# EAGLE design Power_Board (EAGLE 8.2.2)
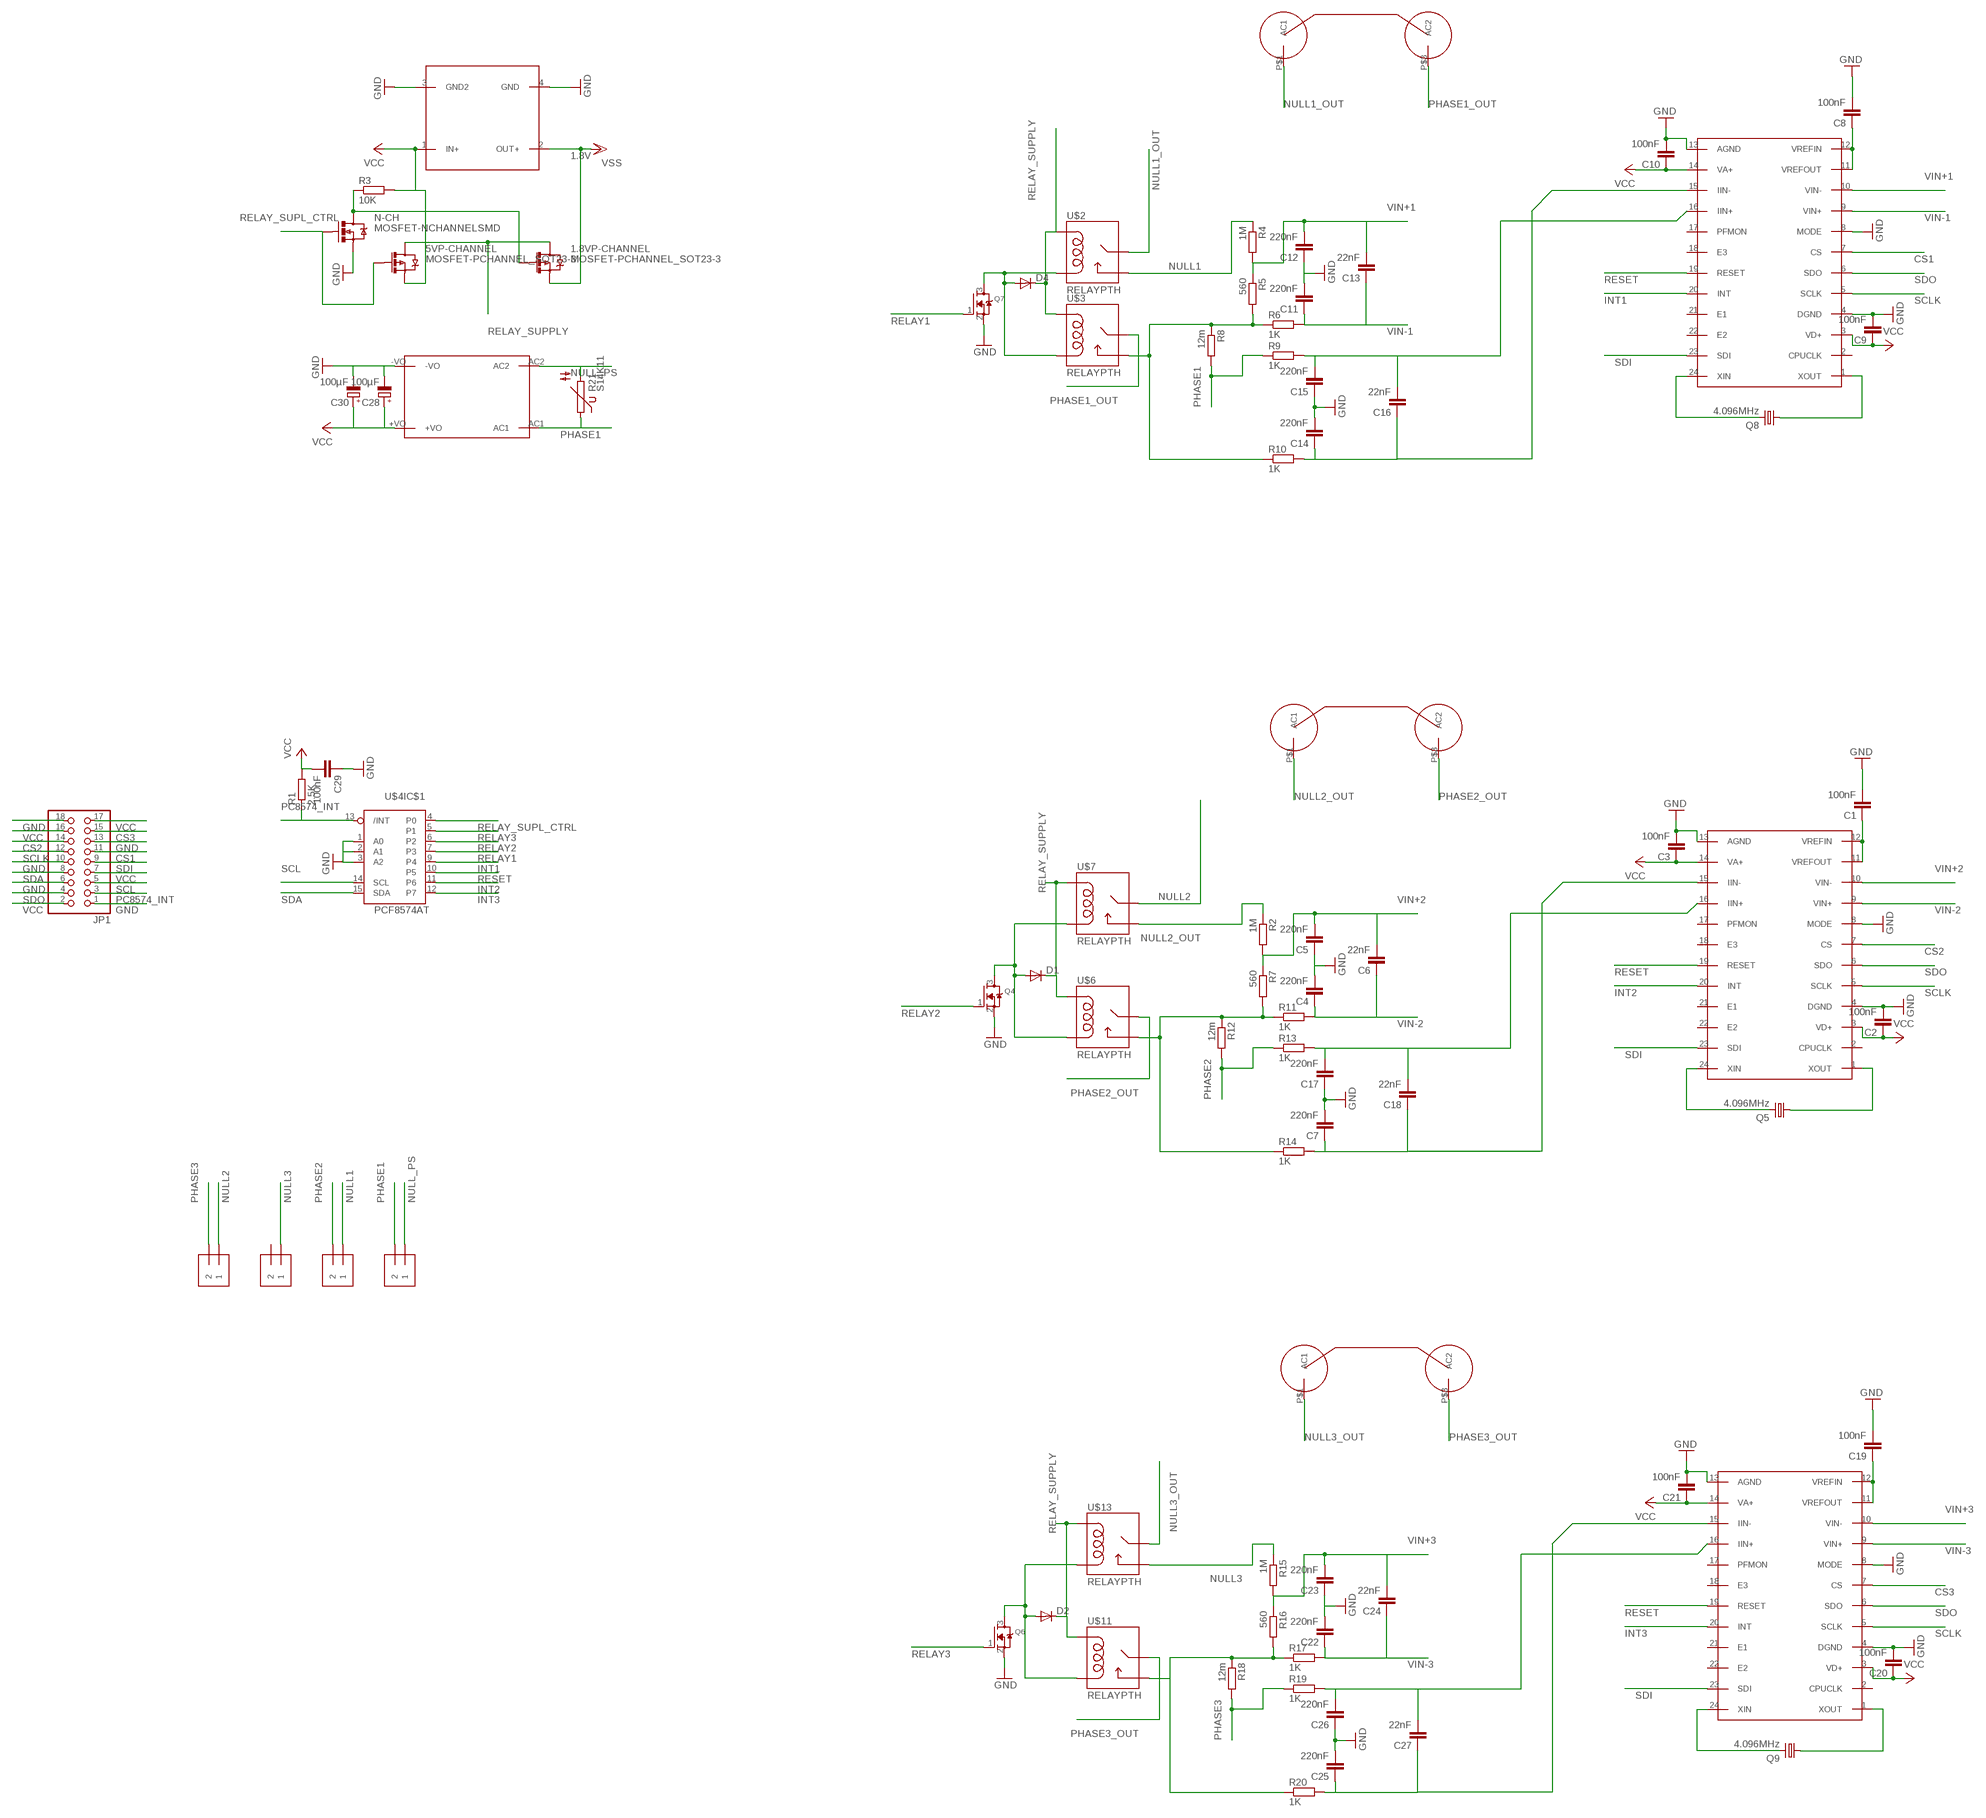
[diagram p0: schematic, sheet 1]

## Parts
1.8VP-CHANNEL  MOSFET-PCHANNEL_SOT23-3  [SOT23-3]
5VP-CHANNEL  MOSFET-PCHANNEL_SOT23-3  [SOT23-3]
C1  100nF  C-EUC0805  [C0805]
C2  100nF  C-EUC0805  [C0805]
C3  100nF  C-EUC0805  [C0805]
C4  220nF  C-EUC0805  [C0805]
C5  220nF  C-EUC0805  [C0805]
C6  22nF  C-EUC0805  [C0805]
C7  220nF  C-EUC0805  [C0805]
C8  100nF  C-EUC0805  [C0805]
C9  100nF  C-EUC0805  [C0805]
C10  100nF  C-EUC0805  [C0805]
C11  220nF  C-EUC0805  [C0805]
C12  220nF  C-EUC0805  [C0805]
C13  22nF  C-EUC0805  [C0805]
C14  220nF  C-EUC0805  [C0805]
C15  220nF  C-EUC0805  [C0805]
C16  22nF  C-EUC0805  [C0805]
C17  220nF  C-EUC0805  [C0805]
C18  22nF  C-EUC0805  [C0805]
C19  100nF  C-EUC0805  [C0805]
C20  100nF  C-EUC0805  [C0805]
C21  100nF  C-EUC0805  [C0805]
C22  220nF  C-EUC0805  [C0805]
C23  220nF  C-EUC0805  [C0805]
C24  22nF  C-EUC0805  [C0805]
C25  220nF  C-EUC0805  [C0805]
C26  220nF  C-EUC0805  [C0805]
C27  22nF  C-EUC0805  [C0805]
C28  100µF  CPOL-EUE5-6  [E5-6]
C29  100nF  C-EUC0805  [C0805]
C30  100µF  CPOL-EUE5-6  [E5-6]
D1  DIODE-DO-214AC  [DO-214AC]
D2  DIODE-DO-214AC  [DO-214AC]
D4  DIODE-DO-214AC  [DO-214AC]
J1  1X2-3.5MM  [1X2-3.5MM]
J2  1X2-3.5MM  [1X2-3.5MM]
J3  1X2-3.5MM  [1X2-3.5MM]
J4  1X2-3.5MM  [1X2-3.5MM]
JP1  PINHD-2X9  [2X09]
N-CH  MOSFET-NCHANNELSMD  [SOT23-3]
Q4  MOSFET-NREFLOW  [SOT23]
Q5  4.096MHz  CRYSTALHC49U70  [HC49U70]
Q6  MOSFET-NREFLOW  [SOT23]
Q7  MOSFET-NREFLOW  [SOT23]
Q8  4.096MHz  CRYSTALHC49U70  [HC49U70]
Q9  4.096MHz  CRYSTALHC49U70  [HC49U70]
R1  2.5K  R-EU_R0805  [R0805]
R2  1M  R-EU_R0805  [R0805]
R3  10K  R-EU_R0805  [R0805]
R4  1M  R-EU_R0805  [R0805]
R5  560  R-EU_R1206  [R1206]
R6  1K  R-EU_R0805  [R0805]
R7  560  R-EU_R1206  [R1206]
R8  12m  R-EU_R2512  [R2512]
R9  1K  R-EU_R0805  [R0805]
R10  1K  R-EU_R0805  [R0805]
R11  1K  R-EU_R0805  [R0805]
R12  12m  R-EU_R2512  [R2512]
R13  1K  R-EU_R0805  [R0805]
R14  1K  R-EU_R0805  [R0805]
R15  1M  R-EU_R0805  [R0805]
R16  560  R-EU_R1206  [R1206]
R17  1K  R-EU_R0805  [R0805]
R18  12m  R-EU_R2512  [R2512]
R19  1K  R-EU_R0805  [R0805]
R20  1K  R-EU_R0805  [R0805]
R21  S14K11  [S14K11]
U$1  STEP_DOWN  [STEP_DOWN]
U$2  RELAYPTH  [SRD-05VDC-SL-C]
U$3  RELAYPTH  [SRD-05VDC-SL-C]
U$4  PCF8574AT  [SO16]
U$5  HLK-PM03  [HLK-PM03]
U$6  RELAYPTH  [SRD-05VDC-SL-C]
U$7  RELAYPTH  [SRD-05VDC-SL-C]
U$8  CS5463  [SSOP24]
U$9  CS5463  [SSOP24]
U$10  POWER_SOCKET_EU  [POWER_SOCKET_EU_PLATED_THROUGH]
U$11  RELAYPTH  [SRD-05VDC-SL-C]
U$12  POWER_SOCKET_EU  [POWER_SOCKET_EU_PLATED_THROUGH]
U$13  RELAYPTH  [SRD-05VDC-SL-C]
U$14  CS5463  [SSOP24]
U$15  POWER_SOCKET_EU  [POWER_SOCKET_EU_PLATED_THROUGH]

## Nets
1.8V: 1.8VP-CHANNEL.2(S) U$1.2(OUT+) ; supply symbol labelled VSS
CS1: JP1.11 U$9.7(CS)
CS2: JP1.14 U$8.7(CS)
CS3: JP1.15 U$14.7(CS)
GND: C1.2 C2.2 C3.2 C4.2 C5.1 C7.2 C8.2 C9.2 C10.2 C11.2 C12.1 C14.2 C15.1 C17.1 C19.2 C20.2 C21.2 C22.2 C23.1 C25.2 C26.1 C28.- C29.1 C30.- JP1.1 JP1.6 JP1.10 JP1.13 JP1.18 N-CH.2(S) Q4.2(S) Q6.2(S) Q7.2(S) U$1.3(GND2) U$1.4(GND) U$4.1(IC$1:A0) U$4.2(IC$1:A1) U$4.3(IC$1:A2) U$5.-VO U$8.4(DGND) U$8.8(MODE) U$8.13(AGND) U$9.4(DGND) U$9.8(MODE) U$9.13(AGND) U$14.4(DGND) U$14.8(MODE) U$14.13(AGND)
INT1: U$4.9(IC$1:P4) U$9.20(INT)
INT2: U$4.11(IC$1:P6) U$8.20(INT)
INT3: U$4.12(IC$1:P7) U$14.20(INT)
N$1: D1.A Q4.3(D) U$6.COIL0 U$7.COIL0
N$2: Q5.1 U$8.1(XOUT)
N$3: C1.1 U$8.11(VREFOUT) U$8.12(VREFIN)
N$4: C7.1 C18.1 R14.2 U$8.15(IIN-)
N$5: Q5.2 U$8.24(XIN)
N$6: R7.2 R11.1 R12.1 R14.1 U$6.SWOPEN
N$7: C17.2 C18.2 R13.2 U$8.16(IIN+)
N$8: D2.A Q6.3(D) U$11.COIL0 U$13.COIL0
N$9: Q9.1 U$14.1(XOUT)
N$10: 1.8VP-CHANNEL.1(G) N-CH.3(D) R3.1
N$11: C19.1 U$14.11(VREFOUT) U$14.12(VREFIN)
N$12: D4.A Q7.3(D) U$2.COIL0 U$3.COIL0
N$13: C25.1 C27.1 R20.2 U$14.15(IIN-)
N$14: Q9.2 U$14.24(XIN)
N$17: Q8.1 U$9.1(XOUT)
N$19: R16.2 R17.1 R18.1 R20.1 U$11.SWOPEN
N$24: C26.2 C27.2 R19.2 U$14.16(IIN+)
N$26: R5.2 R6.1 R8.1 R10.1 U$3.SWOPEN
N$30: C15.2 C16.2 R9.2 U$9.16(IIN+)
N$38: C8.1 U$9.11(VREFOUT) U$9.12(VREFIN)
N$42: C14.1 C16.1 R10.2 U$9.15(IIN-)
N$50: Q8.2 U$9.24(XIN)
NULL1: J2.1 R4.1 U$2.SWOPEN
NULL1_OUT: U$2.SWCOMMON U$12.P$1(AC1)
NULL2: J1.1 R2.1 U$7.SWOPEN
NULL2_OUT: U$7.SWCOMMON U$10.P$1(AC1)
NULL3: J3.1 R15.1 U$13.SWOPEN
NULL3_OUT: U$13.SWCOMMON U$15.P$1(AC1)
NULL_PS: J4.1 R21.2 U$5.AC2
PC8574_INT: JP1.3 R1.1 U$4.13(IC$1:/INT)
PHASE1: J4.2 R8.2 R9.1 R21.1 U$5.AC1
PHASE1_OUT: U$3.SWCOMMON U$12.P$3(AC2)
PHASE2: J2.2 R12.2 R13.1
PHASE2_OUT: U$6.SWCOMMON U$10.P$3(AC2)
PHASE3: J1.2 R18.2 R19.1
PHASE3_OUT: U$11.SWCOMMON U$15.P$3(AC2)
RELAY1: Q7.1(G) U$4.7(IC$1:P3)
RELAY2: Q4.1(G) U$4.6(IC$1:P2)
RELAY3: Q6.1(G) U$4.5(IC$1:P1)
RELAY_SUPL_CTRL: 5VP-CHANNEL.1(G) N-CH.1(G) U$4.4(IC$1:P0)
RELAY_SUPPLY: 1.8VP-CHANNEL.3(D) 5VP-CHANNEL.3(D) D1.C D2.C D4.C U$2.COIL1 U$3.COIL1 U$6.COIL1 U$7.COIL1 U$11.COIL1 U$13.COIL1
RESET: U$4.10(IC$1:P5) U$8.19(RESET) U$9.19(RESET) U$14.19(RESET)
SCL: JP1.5 U$4.14(IC$1:SCL)
SCLK: JP1.12 U$8.5(SCLK) U$9.5(SCLK) U$14.5(SCLK)
SDA: JP1.8 U$4.15(IC$1:SDA)
SDI: JP1.9 U$8.23(SDI) U$9.23(SDI) U$14.23(SDI)
SDO: JP1.4 U$8.6(SDO) U$9.6(SDO) U$14.6(SDO)
VCC: 5VP-CHANNEL.2(S) C2.1 C3.1 C9.1 C10.1 C20.1 C21.1 C28.+ C29.2 C30.+ JP1.2 JP1.7 JP1.16 JP1.17 R1.2 R3.2 U$1.1(IN+) U$5.+VO U$8.3(VD+) U$8.14(VA+) U$9.3(VD+) U$9.14(VA+) U$14.3(VD+) U$14.14(VA+)
VIN+1: C12.2 C13.2 R4.2 R5.1 U$9.10(VIN-)
VIN+2: C5.2 C6.2 R2.2 R7.1 U$8.10(VIN-)
VIN+3: C23.2 C24.2 R15.2 R16.1 U$14.10(VIN-)
VIN-1: C11.1 C13.1 R6.2 U$9.9(VIN+)
VIN-2: C4.1 C6.1 R11.2 U$8.9(VIN+)
VIN-3: C22.1 C24.1 R17.2 U$14.9(VIN+)
Unconnected: J3.2 U$8.2(CPUCLK) U$8.17(PFMON) U$8.18(E3) U$8.21(E1) U$8.22(E2) U$9.2(CPUCLK) U$9.17(PFMON) U$9.18(E3) U$9.21(E1) U$9.22(E2) U$14.2(CPUCLK) U$14.17(PFMON) U$14.18(E3) U$14.21(E1) U$14.22(E2)

## Power pins joined to a net without a drawn wire
GND: U$4.8(PWR:GND)
VCC: U$4.16(PWR:VCC)

## Library data of the parts
1.8VP-CHANNEL 5VP-CHANNEL = Simplex-DiscreteSemi:MOSFET-PCHANNEL: Generic P-channel mosfet
C1-C27 C29 = rcl:C-EU: CAPACITOR, European symbol
C28 C30 = rcl:CPOL-EU: POLARIZED CAPACITOR, European symbol
D1 D2 D4 = diode:DIODE-: DIODE
J1-J4 = adafruit:1X2: 3.5mm Terminal block http://www.ladyada.net/library/pcb/eaglelibrary.html
JP1 = pinhead:PINHD-2X9: PIN HEADER
N-CH = fets:MOSFET-NCHANNEL: Generic NMOS footprint
Q4 Q6 Q7 = adafruit:MOSFET-N: N-Channel Mosfet 2N7002E - 60V 260mA SOT23 [Digikey: 2N7002ET1GOSTR-ND] - REEL BSH103 - 30V 850mA SOT23 [Digikey: 568-5013-1-ND]
Q5 Q8 Q9 = crystal:CRYSTAL: CRYSTAL; OC_FARNELL: unknown; OC_NEWARK: unknown
R1 R3 = resistor:R-EU_: RESISTOR, European symbol
R2 R4-R20 = rcl:R-EU_: RESISTOR, European symbol
R21 = varistor:S14K11: VARISTOR
U$1 = PowerSocket:STEP_DOWN
U$2 U$3 U$6 U$7 U$11 U$13 = PowerSocket:RELAY: SPDT relay (COM-00101)
U$4 = i2c:PCF8574: Remote 8-Bit I/O Expander for I²C Bus
U$5 = PowerSocket:HLK-PM03
U$8 U$9 U$14 = PowerSocket:CS5463
U$10 U$12 U$15 = PowerSocket:POWER_SOCKET_EU

## Board
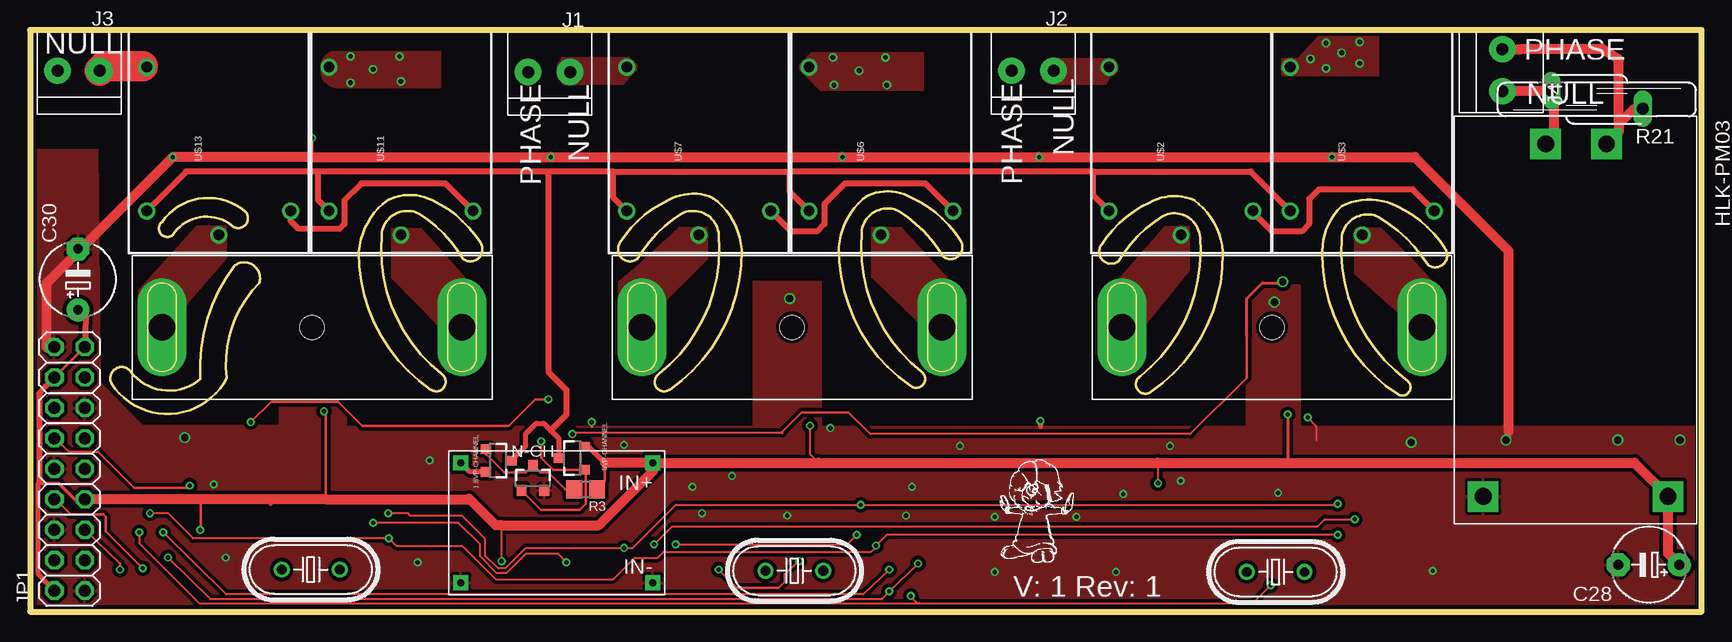
[diagram p1: board, top side]
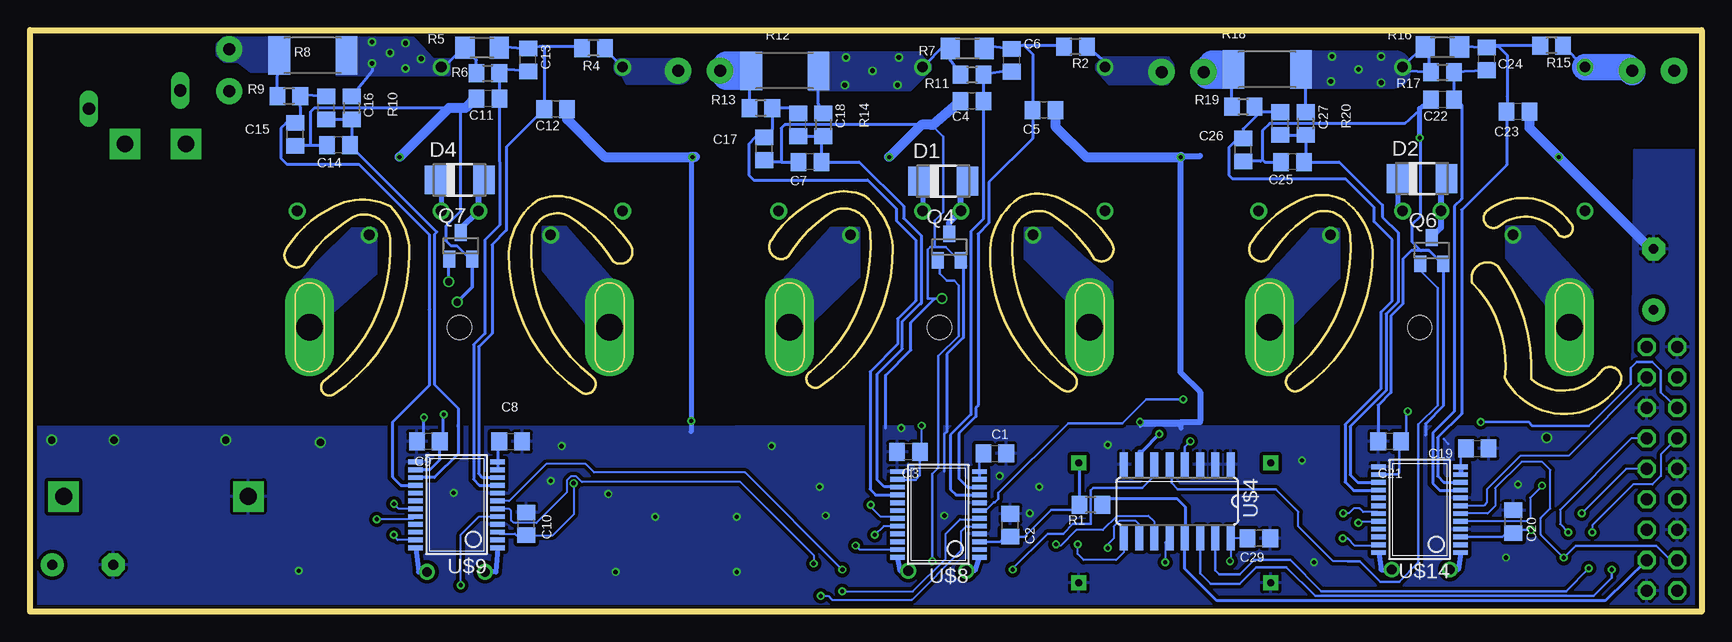
[diagram p2: board, bottom side, seen from below]

Size 139.3 x 48.5 mm. Coordinates in mm from the lower left corner, seen from the top.
Outline: 0,0 139.3,0 139.3,48.5 0,48.5 0,0
Copper layers (1*16): Top 0.035mm / dielectric 1.5mm / Bottom 0.035mm
Design rules "SeeedStudio_2layer_DRU_no_angle_20140221": minimum track width 6mil, minimum drill 12mil, track to track 6mil, track to pad 6mil, pad to pad 6mil, via to via 6mil, smd to smd 0mil, copper to edge 10mil, drill to drill 10mil, minimum pad ring 10mil, minimum via ring 6mil, stop-mask expansion 2mil, vias tented up to drill 100mil, thermal gap 10mil
Milling: 55 lines

### Footprints (pad centres in the part's own frame; a part is rotated, then mirrored left to right if it is on the bottom)
SOT23-3 = smd 0.8 x 0.9: 1 -0.95,-1; 2 0.95,-1; 3 0,1.1
C0805 = smd 1.3 x 1.5: 1 -0.95,0; 2 0.95,0
E5-6 = drill 0.813 pad 1.905: + -2.54,0 | drill 0.813 pad 1.905 octagon: - 2.54,0
DO-214AC = smd 1.8 x 2.4: A 2.025,0; C -2.025,0
1X2-3.5MM = drill 1 pad 2.184: 1 1.8,0; 2 -1.7,0
2X09 = drill 1.016 octagon: 1 -10.16,-1.27; 2 -10.16,1.27; 3 -7.62,-1.27; 4 -7.62,1.27; 5 -5.08,-1.27; 6 -5.08,1.27; 7 -2.54,-1.27; 8 -2.54,1.27; 9 0,-1.27; 10 0,1.27; 11 2.54,-1.27; 12 2.54,1.27; 13 5.08,-1.27; 14 5.08,1.27; 15 7.62,-1.27; 16 7.62,1.27; 17 10.16,-1.27; 18 10.16,1.27
SOT23 = smd 1 x 1.4: 1 -0.95,-1.1; 2 0.95,-1.1; 3 0,1.1
HC49U70 = drill 0.813: 1 -2.413,0; 2 2.413,0
R0805 = smd 1.3 x 1.5: 1 -0.95,0; 2 0.95,0
R1206 = smd 1.6 x 1.803: 1 -1.422,0; 2 1.422,0
R2512 = smd 1.8 x 3.2: 1 -2.8,0; 2 2.8,0
S14K11 = drill 1.016 long: 1 -0.762,-3.81; 2 0.762,3.81
STEP_DOWN = drill 0.6 pad 1.27 square: 1 -8,-5; 2 8,-5; 3 8,5; 4 -8,5
SRD-05VDC-SL-C = drill 0.9: COIL0 -5.39,-6.12; COIL1 -5.39,5.88; SWCOMMON -7.39,-0.12; SWOPEN 6.61,5.88
SO16 = smd 0.66 x 2.032: 1 -4.445,-3.073; 2 -3.175,-3.073; 3 -1.905,-3.073; 4 -0.635,-3.073; 5 0.635,-3.073; 6 1.905,-3.073; 7 3.175,-3.073; 8 4.445,-3.073; 9 4.445,3.073; 10 3.175,3.073; 11 1.905,3.073; 12 0.635,3.073; 13 -0.635,3.073; 14 -1.905,3.073; 15 -3.175,3.073; 16 -4.445,3.073
HLK-PM03 = drill 1.4 pad 2.54 square: +VO 29.4,10.2; -VO 29.4,-5.2; AC1 0,5.08; AC2 0,0
SSOP24 = smd 0.4 x 1.2: 1 -3.575,-3.42; 2 -2.925,-3.42; 3 -2.275,-3.42; 4 -1.625,-3.42; 5 -0.975,-3.42; 6 -0.325,-3.42; 7 0.325,-3.42; 8 0.975,-3.42; 9 1.625,-3.42; 10 2.275,-3.42; 11 2.925,-3.42; 12 3.575,-3.42; 13 3.575,3.42; 14 2.925,3.42; 15 2.275,3.42; 16 1.625,3.42; 17 0.975,3.42; 18 0.325,3.42; 19 -0.325,3.42; 20 -0.975,3.42; 21 -1.625,3.42; 22 -2.275,3.42; 23 -2.925,3.42; 24 -3.575,3.42
POWER_SOCKET_EU_PLATED_THROUGH = drill 2.2 pad 4.064 long: P$1 -12.5,0; P$3 12.5,0 | hole 2: 0,0

### Placement (x,y rotation side)
1.8VP-CHANNEL  39,12.6 270 top
5VP-CHANNEL  45.2,12.8 90 top
C1  58.9,13.2 0 bottom
C2  57.6,7.2 90 bottom
C3  66.1,13.3 180 bottom
C4  60.8,42.57 180 bottom
C5  54.8,41.8 180 bottom
C6  57.5,45.97 90 bottom
C7  74.3,37.5 180 bottom
C8  99.24,14.18 0 bottom
C9  106.1,14.19 180 bottom
C10  97.96,7.31 90 bottom
C11  101.13,42.77 180 bottom
C12  95.5,41.9 180 bottom
C13  97.8,46 90 bottom
C14  113.6,38.9 180 bottom
C15  117.2,39.8 90 bottom
C16  114.6,42 90 bottom
C17  78.1,38.6 90 bottom
C18  75.3,40.6 90 bottom
C19  18.7,13.6 0 bottom
C20  15.7,7.5 90 bottom
C21  26,14.2 180 bottom
C22  21.6,42.7 180 bottom
C23  15.3,41.7 180 bottom
C24  17.9,46.1 90 bottom
C25  34.1,37.5 180 bottom
C26  38.2,38.5 90 bottom
C27  35.1,40.7 90 bottom
C28  134.9,3.9 180 top
C29  36.9,6.1 180 bottom
C30  4,27.7 90 top
D1  63.2,35.9 0 bottom
D2  23.3,36.1 0 bottom
D4  103.5,36 0 bottom
J1  43.2,45 0 top
J2  83.5,45.1 0 top
J3  4,45.1 0 top
J4  122.7,45.2 270 top
JP1  3.3,11.9 90 top
N-CH  41.9,11.1 0 top
Q4  62.7,30.4 0 bottom
Q5  63.7,3.4 0 top
Q6  22.5,30.1 0 bottom
Q7  103.4,30.5 0 bottom
Q8  103.8,3.3 0 top
Q9  23.4,3.5 0 top
R1  50.9,8.9 180 bottom
R2  52.18,47.1 180 bottom
R3  46.3,10.2 0 top
R4  92.35,47 180 bottom
R5  101.62,47.02 180 bottom
R6  101.15,44.9 0 bottom
R7  61.2,46.94 180 bottom
R8  115.73,46.37 180 bottom
R9  117.73,42.99 0 bottom
R10  112.5,42 270 bottom
R11  60.8,44.77 0 bottom
R12  76.4,45.1 180 bottom
R13  78.4,42 0 bottom
R14  73.2,40.6 270 bottom
R15  12.5,47.2 180 bottom
R16  21.6,47.07 180 bottom
R17  21.6,44.97 0 bottom
R18  36.2,45.2 180 bottom
R19  38.2,42.1 0 bottom
R20  33,40.7 270 bottom
R21  130.58,42.7 90 top
U$1  43.9,7.4 180 top
U$2  95.8,38.8 90 top
U$3  110.9,38.8 90 top
U$4  43.7,9.2 180 bottom
U$5  126.3,39 270 top
U$6  70.8,38.8 90 top
U$7  55.6,38.8 90 top
U$8  63.6,8.1 90 bottom
U$9  103.75,8.9 90 bottom
U$10  63.5,23.7 0 top
U$11  30.8,38.8 90 top
U$12  103.5,23.7 0 top
U$13  15.6,38.8 90 top
U$14  23.5,8.5 90 bottom
U$15  23.5,23.7 0 top

### Tracks (layer width: path | path; a pad name or v marks a point on that pad's centre or on a via)
1.8V
  Top 0.406: 1.8VP-CHANNEL.2 36.65,11.65 U$1.2
CS1  (via drill 0.35)
  Top 0.152: v11.1,6.6 16.37,1.44 69.44,1.44 v71.6,3.5
  Bottom 0.152: JP1.11 5.86,14.44 11.8,8.5 11.8,7.3 v11.1,6.6 | v71.6,3.5 79.7,11.6 92.3,11.6 93,12.3 96.3,12.3 99.38,9.22 U$9.7
CS2  (via drill 0.35)
  Top 0.2: v43.2,17.7 42.1,17.7 39.9,15.5 27.7,15.5 25.7,17.5 20.1,17.5 v18.4,15.8
  Bottom 0.2: JP1.14 3.4,18.27 3.4,20.1 4.1,20.8 5.4,20.8 5.9,20.3 5.9,19 9.4,15.5 14.1,15.5 14.4,15.8 v18.4,15.8 | v43.2,17.7 46.3,17.7 48.3,15.7 52.8,15.7 58.6,9.9 58.6,9.4 58.9,9.1 59,9.1 59.67,8.43 U$8.7
CS3
  Bottom 0.152: JP1.15 11.09,13 15.1,13 17.9,10.2 17.9,9.1 18.18,8.82 U$14.7
GND  (via drill 0.35, 0.6)
  Top 0.152: v106.47,16.18 107.2,15.45 107.2,14.3
  Top 0.2: v46.8,15.8 46.8,15.4
  Top 0.406: v23.5,39.5 23.4,39.4 23.4,37.9 | v84.2,15.9 84.2,15.4
  Top 0.813: 1.4,22 1.4,27.4 v11.9,37.9 23.4,37.9 v43.4,37.9 v67.7,37.9 v84.1,37.9 v108.5,37.9 115.4,37.9 123.2,30.1 123.2,15
  Bottom 0.2: Q4.2 61.8,29.3 61.9,29.3 63,30.4 63.9,30.4 | 63.9,30.4 64.3,30.4 64.5,30.2 64.5,26.1 63.9,26.1 v63.3,26.1 | 63.9,30.4 63.9,32.6 63.2,33.3 63.2,39.6 64.2,40.6 | v46.8,15.8 46.8,15.4 | 21.5,14.4 21.1,14 | 62.9,15 63.1,14.8 63.1,11.7
  Bottom 0.254: C11.2 103.05,42 103.4,42 | 103.4,42 115.6,42 115.9,41.7 115.9,38.9 | 115.9,38.9 C14.2 | C17.1 77.95,37.5 76.7,37.5 | 76.7,37.5 C7.2 | 64.2,40.6 76.4,40.6 76.7,40.3 76.7,37.5 | C15.1 117.15,38.9 115.9,38.9 | C22.2 24.75,40.7 36,40.7 36.6,40.1 36.6,37.7 | 36.6,37.7 36.4,37.5 C25.2 | 36.6,37.7 36.75,37.55 C26.1 | 23.4,30.1 24.2,30.1 24.89,29.41 24.89,25.66 25.89,24.66 25.89,18.26 26.95,17.2 C21.2 | 23.4,30.1 22.7,30.1 21.6,29 Q6.2 21.55,28.7 21.53,28.68 21.53,17.13 23,15.66 23,14.7 | 23.4,30.1 24.1,30.8 24.1,32.3 23.4,33 23.4,39.4 v23.5,39.5 | 102.5,29.5 102.7,29.5 103.7,30.5 104.2,30.5 104.6,30.9 104.6,32.2 103.4,33.4 103.4,42 | 61.8,29.3 61.3,28.8 61.52,28.58 61.52,22.84 62.9,21.46 62.9,15 | C9.2 106.47,14.78 v106.47,16.18 | 68,15.3 68,19.7 65.9,21.8 65.9,24.1 63.9,26.1
  Bottom 0.305: Q7.2 102.45,27.05 v103.7,25.8
  Bottom 0.406: C22.2 23.5,41.95 v23.5,39.5 | 43.4,15.8 43.4,15.3 | v46.8,15.8 43.4,15.8 | 43.4,15.8 43.6,15.6 46.7,15.6 | 84.2,37.9 v84.2,15.9 84.2,15
  Bottom 0.508: 43.4,15.8 41.8,15.8 | 41.8,38 43.4,38 v43.4,37.9 43.4,19.9 41.8,18.3 41.8,15.9
  Bottom 0.813: C4.2 64.05,40.6 64.2,40.6 65,40.6 v67.7,37.9 | C23.1 14.35,40.35 v11.9,37.9 4.2,30.2 | C5.1 53.85,40.45 51.3,37.9 v43.4,37.9 | C12.1 94.55,41.05 91.4,37.9 84.2,37.9 v84.1,37.9 83.9,37.9 | 102.1,42.9 103,42 103.4,42 104.4,42 v108.5,37.9
  other vias: 115.1,14.1 123,14.3 132.3,14.3 137.5,14.3 12.9,14.5 49.5,13.9 32.3,4.1 33.3,12.6 77.5,13.8 80.4,7.9 73,8 87.2,7.9 80.4,3.3 90.5,3.3 116.9,3.4 95.9,10.9 15.3,10.6 16.3,4.5 66.7,15.3 63.1,8 56,8.2 58.5,11.3 55.2,10.4 73.5,10.4 91.1,9.8 95,13.8 104,9.9
  pour Bottom (isolate 0.305): -12.6,-10.6 -9.8,-13.4 151.5,-13.4 151.9,-13 151.9,15.5 151.3,15.4 9.8,15.5 9.4,15.5 5.8,19.1 5.6,38.5 -17.2,38.6
  pour Top (isolate 0.305): -12.8,-15 -11.5,-13.7 174.6,-13.7 145.5,15.4 105.8,15.4 105.8,27.2 101.4,27.2 101.4,15.4 65.9,15.4 65.9,27.5 60.3,27.5 60.3,15.4 26.3,15.4 26.3,26.9 20.8,26.9 20.8,15.5 9.4,15.5 5.8,19.1 5.6,38.5 -12.9,38.6 -12.9,-15
INT1  (via drill 0.35)
  Top 0.152: v52,5.6 53.5,7.1 107.3,7.1 107.9,7.7 v110.4,7.7 | v110.4,7.7 110.5,7.7 v110.4,7.7
  Bottom 0.152: 48.14,5.25 U$4.9 48.14,4.96 48.8,4.3 51.5,4.3 52,4.8 v52,5.6 | U$9.20 107.39,7.7 107.86,7.7 107.87,7.7 v110.4,7.7
INT2  (via drill 0.35)
  Top 0.152: v53.8,5.6 68.1,5.6 v68.9,6.4 | v68.9,6.4 69,6.5 v68.9,6.4
  Bottom 0.152: U$4.11 45.61,7.5 46.1,8 48.7,8 49.9,6.8 52.1,6.8 53.4,5.5 53.7,5.5 v53.8,5.6 | v53.8,5.6 53.9,5.7 v53.8,5.6 | U$8.20 68.17,7.12 v68.9,6.4
INT3  (via drill 0.35)
  Top 0.152: v44.7,4.1 44,4.8 41.3,4.8 39.7,3.2 38.9,3.2 37.5,4.6 37.5,5.6 35.7,7.4 v28.6,7.4
  Bottom 0.152: U$4.12 44.7,5.76 v44.7,4.1 44.7,4 | v28.6,7.4 28.47,7.53 U$14.20
N$1
  Top 0.508: U$6.COIL0 74.63,35.7 67.9,35.7 66.2,34 66.2,32.3 65.6,31.7 63.43,31.7 U$7.COIL0
  Bottom 0.508: Q4.3 62.7,32.43 U$7.COIL0 61.72,35.35 D1.A
N$2
  Bottom 0.406: U$8.1 60.59,3.4 Q5.1
N$3
  Bottom 0.2: C1.1 60.18,12.87 U$8.12
  Bottom 0.254: U$8.12 U$8.11
N$4
  Bottom 0.254: C18.1 R14.2 73.35,39.9 C7.1 70.2,37.5 66.5,33.8 66.5,32.8 65,31.3 65,25.7 65.09,25.7 66.59,24.2 66.59,21.91 68.7,19.8 68.7,11 68.1,10.4 67.05,10.4 U$8.15
N$5
  Bottom 0.406: U$8.24 66.81,3.4 Q5.2
N$6  (via drill 0.4)
  Bottom 0.254: U$6.SWOPEN 63.03,47.3 R7.2 62.62,45.97 R11.1 | R14.1 73.6,42.35 R12.1
  other vias: 71.3,46.2 71.4,43.9 69.1,45.1 66.9,46.2 67,43.9
  pour Bottom (no thermals): 74.4,43.5 65.9,43.5 64.2,45.2 64.2,45.6 64.6,46 65.2,46.6 74.4,46.6
  pour Top (no thermals): 74.4,43.5 65.9,43.5 64.2,45.2 64.2,45.6 65.2,46.6 74.4,46.6
N$7
  Bottom 0.254: C18.2 75.35,42 R13.2 77.45,40.2 C17.2 78.85,39.55 79.4,39 79.4,36.4 79,36 69.5,36 67.1,33.6 67.1,32.6 65.5,31 65.5,25.9 67,24.4 67,22.3 69.3,20 69.3,10.2 68.83,9.72 U$8.16
N$8
  Top 0.508: U$11.COIL0 34.63,35.7 27.6,35.7 26.2,34.3 26.2,32.3 25.8,31.9 22.4,31.9 21.72,32.58 U$13.COIL0
  Bottom 0.508: Q6.3 21.72,31.98 U$13.COIL0 21.72,35.66 D2.A
N$9
  Bottom 0.406: U$14.1 20.29,3.5 Q9.1
N$10
  Top 0.2: R3.1 44.6,10.2 43.2,11.6 42.5,11.6 N-CH.3 41.3,11.6 39.5,11.6 38,13.1 1.8VP-CHANNEL.1
N$11
  Bottom 0.2: C19.1 20.08,13.17 U$14.12
  Bottom 0.406: U$14.12 U$14.11
N$12
  Top 0.508: U$3.COIL0 115.23,35.2 107.4,35.2 106.6,34.4 106.6,32.3 106,31.7 103.5,31.7 101.92,33.28 U$2.COIL0
  Bottom 0.508: Q7.3 103.4,31.93 U$2.COIL0 101.92,35.55 D4.A
N$13
  Bottom 0.254: C27.1 R20.2 33,38.15 C25.1 30.2,37.5 26.6,33.9 26.6,32.9 25.29,31.59 25.29,25.83 26.29,24.83 26.29,18.43 29.29,15.43 29.29,11.4 28.67,10.78 U$14.15
N$14
  Bottom 0.406: U$14.24 26.71,3.5 Q9.2
N$17
  Bottom 0.406: U$9.1 100.49,3.3 Q8.1
N$19  (via drill 0.4)
  Bottom 0.2: R17.1 22.65,45.2 22.7,45.2
  Bottom 0.254: R16.2 23.13,47.2 24.77,45.56 | 24.77,45.56 U$11.SWOPEN | R17.1 24.3,45.1 24.77,45.56 | 22.7,45.2 22.7,46.7 | R20.1 33,44.8 R18.1
  other vias: 30.8,46.3 30.9,44.2 28.6,45.2 26.7,46.3 26.7,44.1
  pour Top (no thermals): 34.2,43.7 25.7,43.7 arc-90 24.3,45.1 24.3,45.5 arc-90 25.5,46.7 34.2,46.7
  pour Bottom (no thermals): 34.2,43.7 25.7,43.7 arc-90 24.3,45.1 24.3,45.5 arc-90 25.5,46.7 34.2,46.7
N$24
  Bottom 0.254: C27.2 36.8,41.65 | R19.2 36.8,41.65 | 36.8,41.65 38.2,40.25 C26.2 38.65,39.45 39.4,38.7 39.4,36.4 39.1,36.1 29.7,36.1 27.3,33.7 27.3,32.52 25.79,31.01 25.79,25.91 26.7,25 26.7,18.6 29.7,15.6 29.7,10.8 29,10.1 26.95,10.1 U$14.16
N$26  (via drill 0.4)
  Bottom 0.254: 103.17,47.07 R5.2 | 103.17,47.07 104.83,45.41 U$3.SWOPEN | R6.1 102.1,46 103.17,47.07 | v110.8,45.7 110.8,45.05 R10.1
  other vias: 106.7,46.1 108,47.4 110.8,47.5 108,45.3 109.3,46.6
  pour Top (no thermals): 112.4,48.2 112.4,44.7 104.4,44.7 104.3,44.8 104.3,46.1 105.7,46.1 107.6,48.2
  pour Bottom (no thermals): 113.8,44.7 104.4,44.7 104.3,44.8 104.3,46.1 105.7,46.1 107.6,48.2 113.8,48.2
N$30
  Bottom 0.254: C16.2 116.5,43.15 R9.2 116.75,41.2 C15.2 117.95,40.75 118.4,40.3 118.4,37.8 117.9,37.3 111.9,37.3 106,31.4 106,25.24 | 106,25.24 106,25.2 106.04,25.16 | U$9.16 108.38,10.53 109.06,11.2 109.06,15.82 106,18.89 106,25.24
N$38
  Bottom 0.254: U$9.11 U$9.12 100.33,14.05 C8.1
N$42
  Bottom 0.254: C16.1 R10.2 112.5,39.45 C14.1 105.4,31.65 105.59,31.46 105.59,18.92 103.62,16.95 103.62,15.4 | 103.62,15.4 103.62,15.57 | 103.62,15.4 103.62,13.16 105.61,11.18 U$9.15
N$50
  Bottom 0.406: U$9.24 106.91,3.3 Q8.2
NULL1
  Bottom 0.254: U$2.SWOPEN 91.4,46.89 R4.1
  pour Bottom (no thermals): 85.2,46.1 90.1,46.1 arc-90 90.6,45.6 90.6,45.2 arc-90 90,44.7 89.6,44 85.1,44 arc-90 84.3,44.8 84.3,45.2 arc-90
  pour Top (no thermals): 85.2,46.1 89.9,46.1 arc-90 90.6,45.6 90.6,45.2 arc-90 90,44.7 89.6,44 85.2,44 arc-90 84.3,44.9 84.3,45.2 arc-90
NULL1_OUT
  pour Bottom (no thermals): 96.6,32.1 94.6,32.1 90.7,27.6 90,27.4 89.2,26.5 89.1,21.4 90.1,19.9 91.8,19.9 92.8,20.9 92.9,23.9 96.6,28.5
  pour Top (no thermals): 96.6,32.1 94.6,32.1 90.7,27.6 90,27.4 89.2,26.5 89.1,21.4 90.1,19.9 91.8,19.9 92.8,20.9 92.9,23.9 96.6,28.5
NULL2
  Bottom 0.254: R2.1 49.72,45.87 U$7.SWOPEN
  pour Bottom (no thermals): 50.5,45.2 49.4,44 44.5,44 44,44.7 44,45.6 44.4,46.2 49.9,46.2 50.5,45.6
  pour Top (no thermals): 44.4,46.2 49.9,46.2 50.5,45.6 50.5,45.2 50,44.7 49.4,44 44.5,44 44,44.7 44,45.6
NULL2_OUT
  pour Top (no thermals): 56.4,32 54.1,32 51.2,29.3 50.3,28.5 49.1,27.5 49.2,21.2 50.1,19.9 51.9,19.9 52.9,21.1 52.9,25.9 56.4,29.4
  pour Bottom (no thermals): 56.4,32 54.1,32 51.2,29.3 49.1,27.5 49.1,26.1 49.2,21.2 50.1,19.9 51.9,19.9 52.9,21.1 52.9,25.9 56.4,29.4
NULL3
  Top 2.54: 9.4,45.5 6.2,45.5 J3.1
  Bottom 0.2: J3.1 5.8,45
  Bottom 0.254: R15.1 9.76,45.41 U$13.SWOPEN 9.7,45.4
  Bottom 2.2: 5.8,45 6.2,45.4 9.7,45.4
NULL3_OUT
  pour Bottom (no thermals): 16.3,32.1 13.9,32.1 11.2,29.1 9.1,26.8 9.1,25.9 9.4,20.7 10.2,19.9 12,20 12.7,20.7 12.7,25.3 16.3,29.5
  pour Top (no thermals): 16.3,32.1 13.9,32.1 11.2,29.1 9.1,26.8 9.1,25.9 9.4,20.7 10.2,19.9 12,20 12.7,20.7 12.7,25.3 16.3,29.5
NULL_PS
  Top 0.152: R21.2 126.76,43.46 126.7,43.4
  Top 0.813: J4.1 126.7,43.4 126.99,43.1 126.99,39.69 U$5.AC2
PC8574_INT
  Bottom 0.254: R1.1 49.45,9.4 43.7,9.4 43,8.7 43,6.19 U$4.13 43.06,3.56 40.4,0.9 8.03,0.9 JP1.3
PHASE1
  Top 0.813: 132.4,40.64 132.4,46.05 131.06,46.91 125.52,46.91 124.31,46.9 J4.2 | 132.4,40.64 132.4,40.02 U$5.AC1 | R21.1 133.7,41.94 132.4,40.64
  Top 1.27: U$5.AC1 131.4,39.02
  Bottom 0.254: R9.1 118.65,46.35 R8.2
  pour Bottom (no thermals): 123.8,46.4 123.8,47.3 122.9,48.1 118.5,48.1 118.5,45 120.9,45 122,45.8 123.1,45.8
PHASE1_OUT
  pour Top (no thermals): 110.4,31.8 110.4,28.2 114.1,24.9 114.2,21.1 115,20 116.8,20 117.8,21.1 117.8,26.3 117,27.3 115.4,29.1 112.5,32 110.6,32
  pour Bottom (no thermals): 110.4,31.8 110.4,28.2 113.3,25.6 114.1,24.9 114.2,21.1 115,20 116.8,20 117.7,21 117.8,21.1 117.8,26.3 115.4,29.1 112.5,32 110.6,32
PHASE2
  Bottom 0.15: R12.2 79.2,45.4 79.4,45.6
  Bottom 0.254: 79.4,44.6 79.35,44.55 R13.1
  Bottom 2.2: J2.2 81.3,45.6 79.4,45.6 79.4,44.6 81.3,44.6 J2.2
PHASE2_OUT
  pour Bottom (no thermals): 70.2,32 70.2,27.9 74.1,24.1 74.1,21.4 arc90 75.9,19.9 arc90 77.8,21.4 77.9,26.1 arc90 76.7,27.2 76.6,27.6 72.6,32
  pour Top (no thermals): 70.2,32 70.2,27.9 74.1,24.1 74.1,21.4 arc90 75.9,19.9 arc90 77.8,21.4 77.9,26.1 arc90 76.7,27.2 76.6,27.6 72.6,32
PHASE3
  Bottom 0.2: R18.2 39,45.5 39.2,45.7
  Bottom 0.254: 39.2,44.7 39.2,42.15 R19.1
  Bottom 2.2: J1.2 40.8,45.7 39.2,45.7 39.2,44.7 41.2,44.7 J1.2
PHASE3_OUT
  pour Top (no thermals): 30.2,31.9 30.2,27.8 34.1,23.8 34.2,21.6 arc90 35.9,19.9 arc90 37.9,21.5 37.8,25.9 arc90 36.7,27.3 32.6,31.9
  pour Bottom (no thermals): 30.2,31.9 30.2,27.8 34.1,23.8 34.1,22.1 arc90 35.9,19.9 arc90 37.9,21.4 37.8,26.3 arc90 36.7,27.3 35.3,29 32.6,31.9
RELAY1  (via drill 0.35, 0.6)
  Top 0.152: v45.2,14.8 45.3,14.9 62.7,14.9 | 96.7,14.8 70,14.8
  Top 0.2: 101.4,23 101.4,19.5 96.7,14.8 | 45.2,14.9 v45.2,14.8 | 70,14.8 68.2,16.6 64.3,16.6 62.7,15 62.7,14.9
  Top 0.254: v104.4,27.5 104.3,27.4 102.7,27.4 101.4,26.1 101.4,23
  Bottom 0.254: U$4.7 46.88,13.38 | v104.4,27.5 104.4,29.35 Q7.1
  Bottom 0.305: 46.88,13.38 46.62,13.38 v45.2,14.8
RELAY2  (via drill 0.35)
  Top 0.152: v64.1,4.2 64,4.2
  Top 0.2: v57.4,3.5 58.9,2 62.4,2 62.9,2.5 62.9,3.1 64,4.2
  Bottom 0.2: U$4.6 45.61,11.29 46.6,10.3 50.7,10.3 50.9,10.1 50.9,7.3 52.4,7.3 53.2,6.5 54.5,6.5 57.4,3.6 v57.4,3.5 | Q4.1 63.5,29.15 63.5,28.2 62.9,27.6 62.3,27.6 61.9,27.2 61.9,23 63.6,21.3 63.6,12 64.1,11.5 v64.1,4.2
RELAY3
  Bottom 0.152: 29.5,4.2 30.7,4.2 33.6,7.1 33.6,8.3 35.5,10.2
  Bottom 0.2: Q6.1 23.45,28.42 22,26.97 22,17.2 23.6,15.6 23.6,4.1 25.2,2.5 26.8,2.5 28.5,4.2 29.5,4.2 | 44.33,11.63 44.16,11.46 44.16,10.72 43.64,10.2 35.5,10.2
  Bottom 0.254: 44.33,11.63 U$4.5
RELAY_SUPL_CTRL  (via drill 0.35)
  Top 0.2: N-CH.1 42.55,8.5 45.8,8.5 46.3,9 46.3,11.75 5VP-CHANNEL.1 46.15,11.8 43.6,11.8 42.6,12.8 v42.6,14.2
  Bottom 0.2: 43.06,12.67 U$4.4 43.06,13.73 v42.6,14.2
RELAY_SUPPLY
  Top 0.406: 1.8VP-CHANNEL.3 41.3,13.8 41.3,14.8 42.2,15.7 42.8,15.7 43.4,15.1 44.1,14.4 5VP-CHANNEL.3
  Top 0.508: U$3.COIL1 101.73,36.7 88.6,36.7 | U$13.COIL1 13.01,36.7 24,36.7 | 48.6,36.7 63.3,36.7 | 48.6,36.7 43.2,36.7 | 43.2,36.7 24,36.7 | 88.6,36.7 63.3,36.7 | U$11.COIL1 24,34.33 24,36.7 | U$6.COIL1 63.3,35.03 63.3,36.7 | U$2.COIL1 88.6,34.73 88.6,36.7 | U$7.COIL1 48.6,34.53 48.6,36.7 | 43.4,15.1 44.7,16.4 44.7,18.5 43.2,20 43.2,36.7
  Bottom 0.406: D2.C 25.32,33.81 U$11.COIL1 | D1.C 64.92,35.59 U$6.COIL1 | D4.C 105.02,35.49 U$3.COIL1
RESET  (via drill 0.35)
  Top 0.152: 29.8,8.2 v29.86,8.2 31.5,8.2 31.7,8 36,8 37.9,6.1 37.9,4.7 39,3.6 39.6,3.6 41.3,5.3 v49.5,5.3 50.23,5.3 53.83,8.9 v69.23,8.9 109,8.9 108.97,8.93 v108.97,8.97
  Bottom 0.152: U$4.10 46.88,7.28 47.2,7.6 48.5,7.6 49,7.1 49,6.1 49.5,5.6 v49.5,5.3 | U$9.19 108.58,8.57 v108.97,8.97 109.1,9.1 | U$14.19 27.04,8.3 28.2,8.3 28.5,8.6 29,8.6 29.4,8.2 v29.86,8.2 | U$8.19 67.14,7.9 68.4,7.9 69.2,8.7 69.2,8.9 v69.23,8.9
SCL  (via drill 0.35)
  Top 0.2: v7.5,3.5 7.5,3.97 JP1.5
  Bottom 0.2: U$4.14 41.8,3.19 40.9,2.3 38.5,2.3 37.1,3.7 34.6,3.7 32.2,1.3 9,1.3 7.5,2.8 v7.5,3.5 7.5,3.6
SCLK  (via drill 0.35)
  Top 0.152: v9.1,6.6 9.1,5.7 14.1,0.7 74.1,0.7 101.9,0.7 v103.4,2.2
  Top 0.2: JP1.12 3.25,13.3 5.7,13.3 8.7,10.3 13.3,10.3 v13.3,10.5 | 74.1,0.7 73.8,0.7 73.8,0.8 73.3,1.3 v73.4,1.3
  Bottom 0.152: JP1.12 2.11,14.39 3.4,13.1 3.4,11.3 4.1,10.6 5.7,10.6 9.1,7.2 v9.1,6.6 | v103.4,2.2 103.4,6.4 101.88,7.92 U$9.5 | v13.3,10.5 14.3,9.5 14.3,7.8 14.57,7.53 U$14.5 | v73.4,1.3 72.8,1.3 72.5,1 65.8,1 61.7,5.1 61.7,6.7 61.27,7.12 U$8.5
  Bottom 0.2: U$14.5 20,7.6
SDA  (via drill 0.35)
  Top 0.2: v9.4,3.6 6.3,6.7 6.3,7.9 6.1,8.1 3.4,8.1 2.14,9.36 JP1.8
  Bottom 0.2: U$4.15 40.53,3.42 40.2,3.1 38.5,3.1 37.3,4.3 34.3,4.3 31.7,1.7 11.3,1.7 v9.4,3.6
SDI  (via drill 0.35)
  Top 0.152: v108.98,6.4 71.4,6.4 70.55,5.55 | v10,8.2 11.5,8.2 13.6,6.1 v29.9,6.1 30.5,5.5 36,5.5 38.8,2.7 48.6,2.7 50.4,4.5 52.3,4.5 52.8,5 70.1,5 70.55,5.45 70.55,5.55 | 70.55,5.55 v70.5,5.5
  Bottom 0.152: v10,8.2 6.3,11.9 JP1.9 | U$9.23 108.67,5.97 109.1,6.4 v108.98,6.4 | U$14.23 27,5.5 28.9,5.5 29.5,6.1 v29.9,6.1 | v70.5,5.5 70.17,5.17 U$8.23
SDO  (via drill 0.35)
  Top 0.152: v11.5,4.5 15.02,1.06 70.98,1.08 | v71.6,1.68 v74,4
  Top 0.2: 70.98,1.08 71,1.08 v71.6,1.68
  Bottom 0.152: 10.5,5.5 v11.5,4.5 13.4,6.4 13.4,7.8 12.6,8.6 12.6,11.8 13.3,12.5 15,12.5 17.2,10.3 17.2,8.8 17.82,8.18 U$14.6 | 74,3.9 v74,4 74,4.7 80.1,10.8 93.31,10.8 93.77,11.26 94.23,11.26 94.56,10.93 94.56,9.94 97.11,7.39 98.8,7.39 98.81,7.4 99,7.4 99.2,7.6 99.2,8.4 99.38,8.57 U$9.6 | v71.6,1.68 65.72,1.68 63,4.4 63,6.5 61.8,7.7 60.25,7.7 U$8.6
  Bottom 0.2: JP1.4 2.58,4.28 3.8,5.5 10.5,5.5
VCC  (via drill 0.35)
  Top 0.152: 39,7 38.8,7.2 | v39.3,4.2 39.3,7.2 | v94,10.7 94,12.36 93.96,12.4 | 65.7,12.4 65,13.1 v65,15.5 | v65,15.5 65,15.7 v65,15.5
  Top 0.2: 47.9,12.4 47.9,10.85 R3.2 | v14.2,6.8 14.24,6.74 14.24,9.36 | v24.5,16.7 24.64,16.56 24.64,9.36
  Top 0.203: 0.76,10.7 0.71,10.7 0.7,10.7
  Top 0.254: JP1.17 JP1.16 | v104.82,16.43 v104.81,16.43 104.81,12.4
  Top 0.305: JP1.7 3.74,9.36 2.4,10.7 0.76,10.7 | 0.7,10.7 0.66,10.66 | 23.1,9.4 20.5,9.4 20.05,8.95 19.64,9.36 14.24,9.36
  Top 0.406: 5VP-CHANNEL.2 46.55,13.75 47.9,12.4 | JP1.2 0.71,3.14 0.71,10.7
  Top 0.508: JP1.16 0.76,18.17 0.76,10.7 | C30.+ 4.65,24.51 JP1.17
  Top 0.813: C28.+ 136.5,4.84 U$5.+VO 133.7,12.4 104.81,12.4 93.96,12.4 65.7,12.4 U$1.1 | U$1.1 47.9,12.4 | U$1.1 51.9,11.7 47.4,7.2 39.3,7.2 38.8,7.2 36.6,9.4 36.56,9.36 24.64,9.36 14.24,9.36 JP1.7
  Bottom 0.152: C29.2 39.23,6.1 U$4.16 39.25,4.45 39.3,4.4 v39.3,4.2 | v94,10.7 94,8.1 95.74,6.36 C10.1 98.76,6.36 98.9,6.5 100.21,6.5 U$9.3 | 64.85,13.6 C3.1 65,13.45 v65,15.5
  Bottom 0.2: U$14.14 25.38,11.43 25.2,11.6 25.2,14.05 C21.1 24.6,14.65 24.6,16.5 24.5,16.6 v24.5,16.7 | U$14.3 16.62,6.22 16.3,6.55 C20.1 15.45,6.8 v14.2,6.8 | R1.2 52.25,8.5 54.2,8.5 56.45,6.25 C2.1 58.05,6.25 58.5,5.8 60.16,5.8 U$8.3 | U$8.14 66.99,11 65.5,11 65.15,11.35 C3.1
  Bottom 0.254: U$1.1 51.85,12.35 R1.2 | U$9.14 107.13,11.86 105.94,11.86 105.15,12.65 C9.1 104.84,14.5 104.84,16.43 v104.82,16.43
VIN+1
  Bottom 0.254: R4.2 93.35,47.15 96.6,47.15 | R5.1 100.15,47.15 C13.2 96.6,47.15 | 96.6,47.15 96.45,47 C12.2 99.6,38.75 99.6,31.8 100.8,30.6 100.8,23.21 101.92,22.08 101.92,11.51 101.59,11.18 U$9.10
VIN+2
  Bottom 0.254: R2.2 53.1,47.25 56.5,47.25 | 56.5,47.25 C6.2 59.73,47.25 R7.1 | 56.5,47.25 55.75,46.5 C5.2 55.75,39.45 59.4,35.8 59.4,32.4 60.3,31.5 60.3,17.2 60.49,17.01 60.49,16.26 61.9,14.85 61.9,11.1 61.17,10.38 U$8.10
VIN+3
  Bottom 0.254: C24.2 20.13,47.15 R16.1 | R15.2 17.85,47.2 C24.2 | C24.2 16.95,47.15 16.2,46.4 16.2,42.95 C23.2 16.25,37.25 20,33.5 20,16.5 21.99,14.51 21.99,11.3 21.47,10.78 U$14.10
VIN-1
  Bottom 0.254: C13.1 100.05,45.25 R6.2 100.2,43.05 C11.1 100.15,32.25 101.4,31 101.4,23.18 102.33,22.25 102.33,11.02 101.85,10.54 100.35,10.54 U$9.9
VIN-2
  Bottom 0.254: C6.1 57.75,45.1 R11.2 C4.1 59.85,32.75 60.89,31.71 60.89,16.43 62.6,14.72 62.6,10.2 62.12,9.72 U$8.9
VIN-3
  Bottom 0.254: C24.1 18.05,45.1 R17.2 C22.1 20,42.25 20,34.4 20.6,33.8 20.6,16.7 22.4,14.9 22.4,10.7 21.82,10.12 U$14.9

### Text on the board
tPlace: NULL | PHASE | NULL | NULL | NULL | PHASE | PHASE | V: 1 Rev: 1